# Altium schematic sheet Motor Driver 175C_Phase3.SchDoc: Motor Driver
size Tabloid; CompanyName: Vertex; Organization: Vertex Downhole Ltd.; Address1: 10911 50th Street SE; Address2: Calgary, AB; Address3: T2C 3E5; Address4: Canada; DocumentNumber: 550014; Revision: 4.1; SheetNumber: 8; SheetTotal: 8
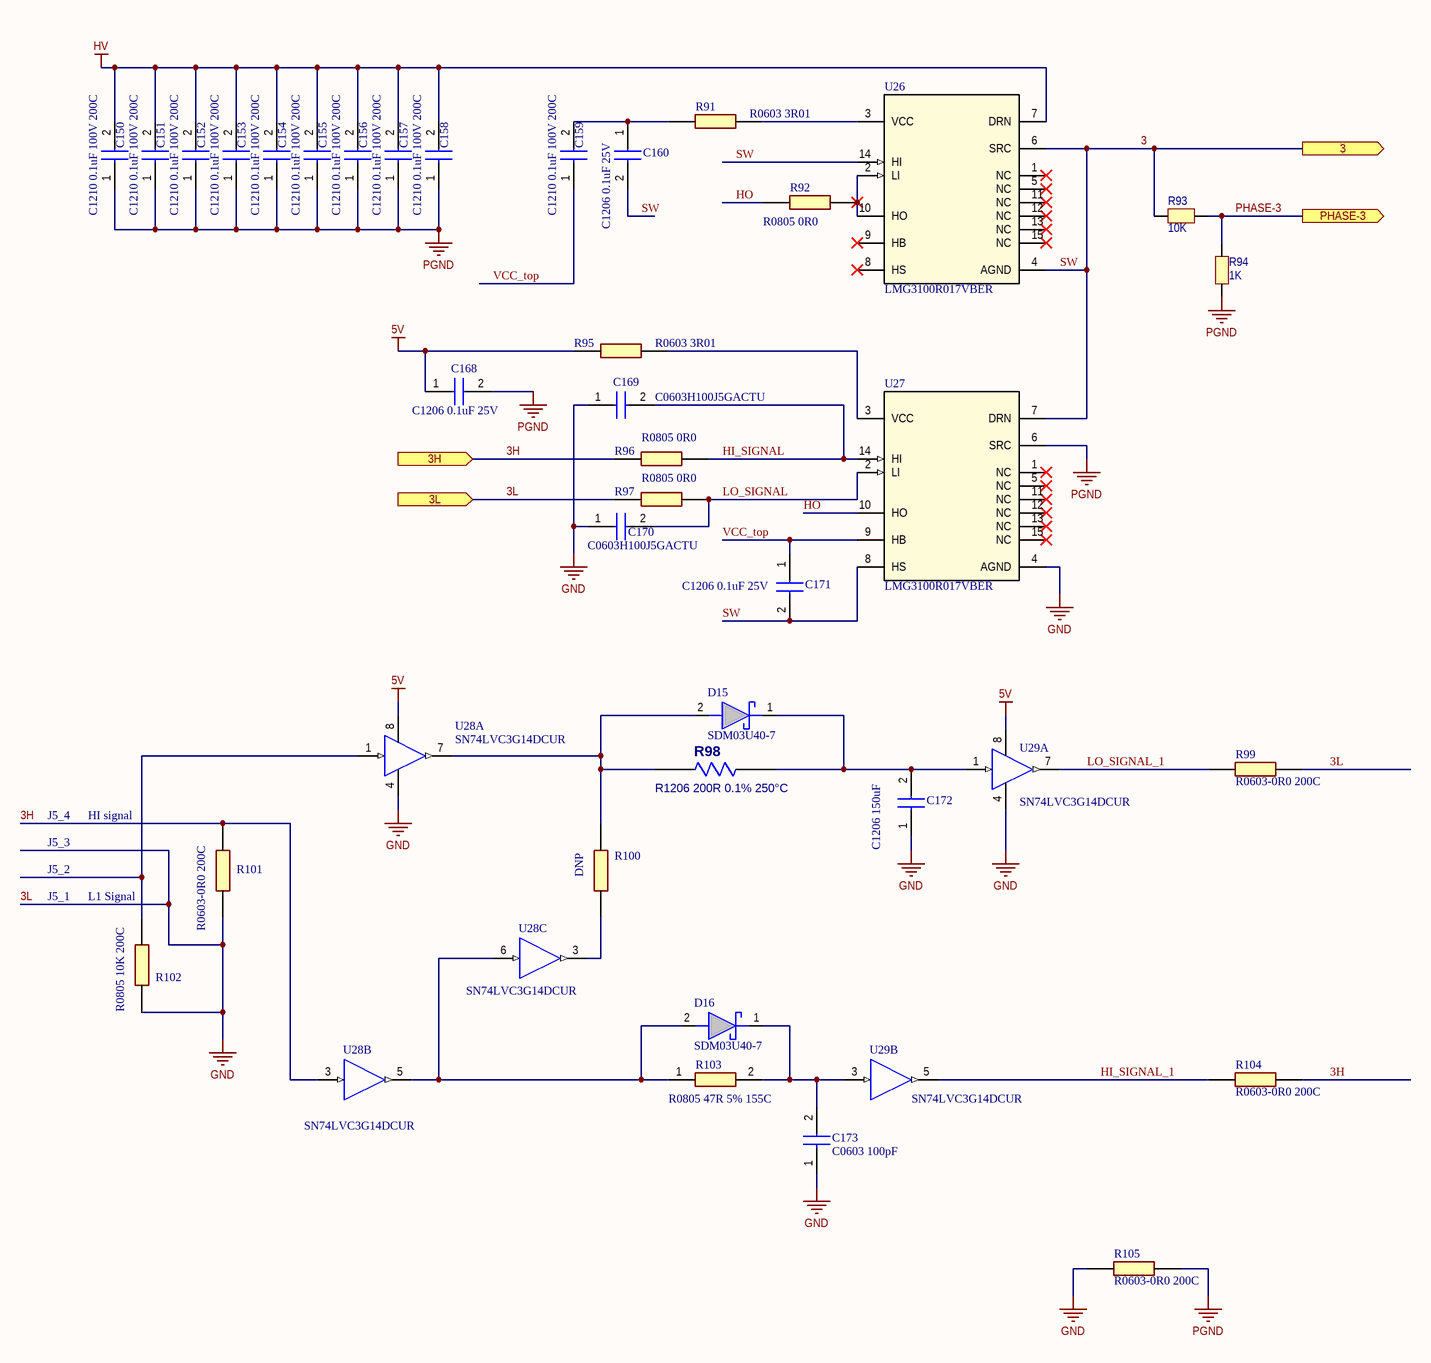
[diagram p0: Motor Driver 175C_Phase3.SchDoc]

## Parts
C150  C1210 0.1uF 100V 200C  [C1210]
C151  C1210 0.1uF 100V 200C  [C1210]
C152  C1210 0.1uF 100V 200C  [C1210]
C153  C1210 0.1uF 100V 200C  [C1210]
C154  C1210 0.1uF 100V 200C  [C1210]
C155  C1210 0.1uF 100V 200C  [C1210]
C156  C1210 0.1uF 100V 200C  [C1210]
C157  C1210 0.1uF 100V 200C  [C1210]
C158  C1210 0.1uF 100V 200C  [C1210]
C159  C1210 0.1uF 100V 200C  [C1210]
C160  C1206 0.1uF 25V  [C1206]
C168  C1206 0.1uF 25V  [C1206]
C169  C0603H100J5GACTU  [C0603]
C170  C0603H100J5GACTU  [C0603]
C171  C1206 0.1uF 25V  [C1206]
C172  C1206 150uF  [C1206]
C173  C0603 100pF  [C0603]
D15  SDM03U40-7  [SODFL1608X65N]
D16  SDM03U40-7  [SODFL1608X65N]
R91  R0603 3R01  [RESC1608X55N]
R92  R0805 0R0  [RESC2012X60N]
R93  10K  [0805-CR]
R94  1K  [0805-CR]
R95  R0603 3R01  [RESC1608X55N]
R96  R0805 0R0  [RESC2012X60N]
R97  R0805 0R0  [RESC2012X60N]
R98  R1206 200R 0.1% 250°C  [R1206]
R99  R0603-0R0 200C  [RESC1508X63N]
R100  DNP  [RESC1508X63N]
R101  R0603-0R0 200C  [RESC1508X63N]
R102  R0805 10K 200C  [RESC2013X46N]
R103  R0805 47R 5% 155C  [RESC2012X65N]
R104  R0603-0R0 200C  [RESC1508X63N]
R105  R0603-0R0 200C  [RESC1508X63N]
U26  LMG3100R017VBER  [VBE0015A-MFG]
U27  LMG3100R017VBER  [VBE0015A-MFG]
U28  SN74LVC3G14DCUR  [SOP50P310X90-8N]  (parts A,B,C of 3)
U29  SN74LVC3G14DCUR  [SOP50P310X90-8N]  (parts A,B of 3)

## Ports
3 (out), 3H (in), 3L (in), PHASE-3 (out)

## Nets
3L: C169.1 C170.1 C172.1 C173.1 R97.1 R99.1 R101.1 R102.1 R105.2 U27.4(AGND) U28.4(GND) U29.4(GND) ; port 3L  [also labelled GND]
5V: C168.1 R95.1 U28.8(VCC) U29.8(VCC)
HV: C150.2 C151.2 C152.2 C153.2 C154.2 C155.2 C156.2 C157.2 C158.2 U26.7(DRN)
PGND: C150.1 C151.1 C152.1 C153.1 C154.1 C155.1 C156.1 C157.1 C158.1 C168.2 R94.1 R105.1 U27.6(SRC)
3: C160.2 C171.2 R93.1 U26.4(AGND) U26.6(SRC) U26.14(HI) U27.7(DRN) U27.8(HS) ; port 3  [also labelled SW]
3H: R96.1 R101.2 R104.1 U28.3(A) ; port 3H
HI_SIGNAL: C169.2 R96.2 U27.14(HI)
HI_SIGNAL_1: R104.2 U29.5(Y)
HO: R92.1 U27.10(HO)
LO_SIGNAL: C170.2 R97.2 U27.2(LI)
LO_SIGNAL_1: R99.2 U29.7(Y)
PHASE-3: R93.2 R94.2 ; port PHASE-3
VCC_top: C159.1 C171.1 U27.9(HB)
NetC159_2: C159.2 C160.1 R91.1
NetC172_2: C172.2 D15.1(K) R98.2(B) U29.1(A)
NetC173_2: C173.2 D16.1(K) R103.2 U29.3(A)
NetD15_2: D15.2(A) R98.1(A) R100.2 U28.7(Y)
NetD16_2: D16.2(A) R103.1 U28.5(Y) U28.6(A)
NetR91_2: R91.2 U26.3(VCC)
NetR92_2: R92.2 U26.2(LI) U26.10(HO)
NetR95_2: R95.2 U27.3(VCC)
NetR100_1: R100.1 U28.3(Y)
NetR102_2: R102.2 U28.1(A)

Not connected (* = marked no-connect by the designer): U26 1(NC)* 5(NC)* 8(HS)* 9(HB)* 11(NC)* 12(NC)* 13(NC)* 15(NC)*; U27 1(NC)* 5(NC)* 11(NC)* 12(NC)* 13(NC)* 15(NC)*

## Notes on the sheet
- J5_4
- HI signal
- J5_1
- J5_2
- J5_3
- (near R102) L1 Signal
- Title
- Size:
- Date:
- Tabloid
- Number:
- Time:
- Revision:
- Sheet
- of
- File:

## Library data of the parts
C150-C159 = C1210H104J1GACTU: Capacitor; Manufacturer_Name: KEMET; Datasheet Link: https://content.kemet.com/datasheets/KEM_C1001_C0G_200C_SMD.pdf; Manufacturer_Part_Number: C1210H104J1GACTU; Mouser Part Number: 80-C1210H104J1GACTU; Mouser Price/Stock: https://www.mouser.co.uk/ProductDetail/KEMET/C1210H104J1GACTU?qs=w3%252Bcv6FlocpP4mccX4tnSA%3D%3D; Operating Temperature Range: -55C to +200C
C160 C168 C171 = C1206H104J3GACTU: Capacitor; Manufacturer_Name: KEMET; Datasheet Link: https://content.kemet.com/datasheets/KEM_C1001_C0G_200C_SMD.pdf; Manufacturer_Part_Number: C1206H104J3GACTU; Mouser Part Number: 80-C1206H104J3GACTU; Mouser Price/Stock: https://www.mouser.co.uk/ProductDetail/KEMET/C1206H104J3GACTU?qs=w3%252Bcv6Flocqnd9vvLtBgyg%3D%3D
C169 C170 C173 = C0603H100J5GACTU: Capacitor; Manufacturer_Name: KEMET; Datasheet Link: https://content.kemet.com/datasheets/KEM_C1001_C0G_200C_SMD.pdf; Height: 0.87mm; Manufacturer_Part_Number: C0603H100J5GACTU
C172 = C1206H151J1GACT500: Capacitor; Manufacturer_Name: KEMET; Datasheet Link: https://content.kemet.com/datasheets/KEM_C1001_C0G_200C_SMD.pdf; Manufacturer_Part_Number: C1206H151J1GACT500; Mouser Part Number: 80-C1206H151J1GT500; Mouser Price/Stock: https://www.mouser.com/Search/Refine.aspx?Keyword=80-C1206H151J1GT500
D15 D16 = SDM03U40-7: Diodes Inc SDM03U40-7, SMT Schottky Diode, 40V 30mA, 2-Pin SOD-523; Manufacturer_Name: Diodes Incorporated; Geometry.Height: 0.65mm; Mouser Part Number: 621-SDM03U40-F; Mouser Price/Stock: https://www.mouser.co.uk/ProductDetail/Diodes-Incorporated/SDM03U40-7?qs=BJo294706Gz61ae%252BKxKOIA%3D%3D; Manufacturer_Part_Number: SDM03U40-7; Datasheet Link: https://www.diodes.com//assets/Datasheets/SDM03U40.pdf
R91 R95 = CPF0603F3R01C1: Configuration Features: Number of Resistors 1; Manufacturer_Name: TE Connectivity; Geometry.Height: 0.55mm; Mouser Part Number: *; Mouser Price/Stock: *; Manufacturer_Part_Number: CPF0603F3R01C1; Datasheet Link: *
R92 R96 R97 = CR0805AJ_-000EAS: Thick Film Resistors - SMD ResA-AS 0805 0R Jumper 125mW; Manufacturer_Name: Bourns; Manufacturer_Part_Number: CR0805AJ/-000EAS; Geometry.Height: 0.6mm; Mouser Part Number: 652-CR0805AJ/-000EAS; Mouser Price/Stock: https://www.mouser.co.uk/ProductDetail/Bourns/CR0805AJ-000EAS?qs=PzGy0jfpSMu9sqFdv6iQ3A%3D%3D; Datasheet Link: https://componentsearchengine.com/Datasheets/1/CR0805AJ_-000EAS.pdf
R93 = RES: Resistor; Manufacturer: Yageo; Vendor PN: 311-10.0KCRCT-ND; Vendor: Digi-Key; Manu PN: RC0805FR-0710KL; Vertex PN: 6181002
R94 = RES: Resistor; Manufacturer: Yageo; Vendor PN: 311-1.00KCRCT-ND; Vendor: Digi-Key; Manu PN: RC0805FR-071KL; Vertex PN: 6180102
R98 = RC_1206: 1206; Part Field 1: SMD PATT1206 25PPM 200 0.1% G T1 e1; MPN: PATT1206E2000BGT1; Mfr: Vishay Dale Thin Film
R99 R101 R104 R105 = PZHT0603-0R00GT: Thin Film Resistors - SMD Zero ohm Jumper 230 C; Manufacturer_Name: Vishay; Geometry.Height: 0.627mm; Mouser Part Number: 72-PZHT0603-0R00GT; Mouser Price/Stock: https://www.mouser.co.uk/ProductDetail/Vishay-Sfernice/PZHT0603-0R00GT?qs=HVbQlW5zcXWTEyxPn1S2Gw%3D%3D; Manufacturer_Part_Number: PZHT0603-0R00GT; Datasheet Link: https://www.vishay.com/docs/53056/pzht.pdf
R100 = PZHT0603-0R00GT: Thin Film Resistors - SMD Zero ohm Jumper 230 C; Manufacturer_Name: Vishay; Geometry.Height: 0.627mm; Instruction: Do Not Populate (DNP); Mouser Part Number: 72-PZHT0603-0R00GT; Mouser Price/Stock: https://www.mouser.co.uk/ProductDetail/Vishay-Sfernice/PZHT0603-0R00GT?qs=HVbQlW5zcXWTEyxPn1S2Gw%3D%3D; Manufacturer_Part_Number: PZHT0603-0R00GT; Datasheet Link: https://www.vishay.com/docs/53056/pzht.pdf
R102 = PATT0805E1002BGT1: Thin Film Resistors - SMD .20watt 10Kohm .1% 25ppm; Manufacturer_Name: Vishay; Geometry.Height: 0.457mm; Mouser Part Number: 71-PATT0805E1002BGT1; Mouser Price/Stock: https://www.mouser.co.uk/ProductDetail/Vishay-Thin-Film/PATT0805E1002BGT1?qs=bEWkMhb0NhPhNVw7lvEHVQ%3D%3D; Manufacturer_Part_Number: PATT0805E1002BGT1; Datasheet Link: https://www.vishay.com/docs/60124/patt.pdf
R103 = KTR10EZPJ470: Resistor; Manufacturer_Name: ROHM Semiconductor; Datasheet Link: http://rohmfs.rohm.com/en/products/databook/datasheet/passive/resistor/chip_resistor/ktr.pdf; Height: 0.65mm; Manufacturer_Part_Number: KTR10EZPJ470; Mouser Part Number: 755-KTR10EZPJ470; Mouser Price/Stock: https://www.mouser.co.uk/ProductDetail/ROHM-Semiconductor/KTR10EZPJ470?qs=DyUWGjl%252BcVtYPh6oRykbUQ%3D%3D
U26 U27 = LMG3100R017VBER: 100V 1.7mÎ© GaN FET with integrated driver 15-VQFN-FCRLF -40 to 175; Manufacturer_Name: Texas Instruments; TYPE: TYPE; RefDes: RefDes; Copyright: Copyright (C) 2025 Ultra Librarian. All rights reserved.; Manufacturer_Part_Number: LMG3100R017VBER
U28 U29 = SN74LVC3G14DCUR: Inverters Triple Schmitt-Trgr; Manufacturer_Name: Texas Instruments; Geometry.Height: 0.9mm; Mouser Part Number: 595-SN74LVC3G14DCUR; Mouser Price/Stock: https://www.mouser.co.uk/ProductDetail/Texas-Instruments/SN74LVC3G14DCUR?qs=j%2FZo4ajzVJLLsWxs54Kt5w%3D%3D; Manufacturer_Part_Number: SN74LVC3G14DCUR; Datasheet Link: https://www.ti.com/lit/gpn/SN74LVC3G14